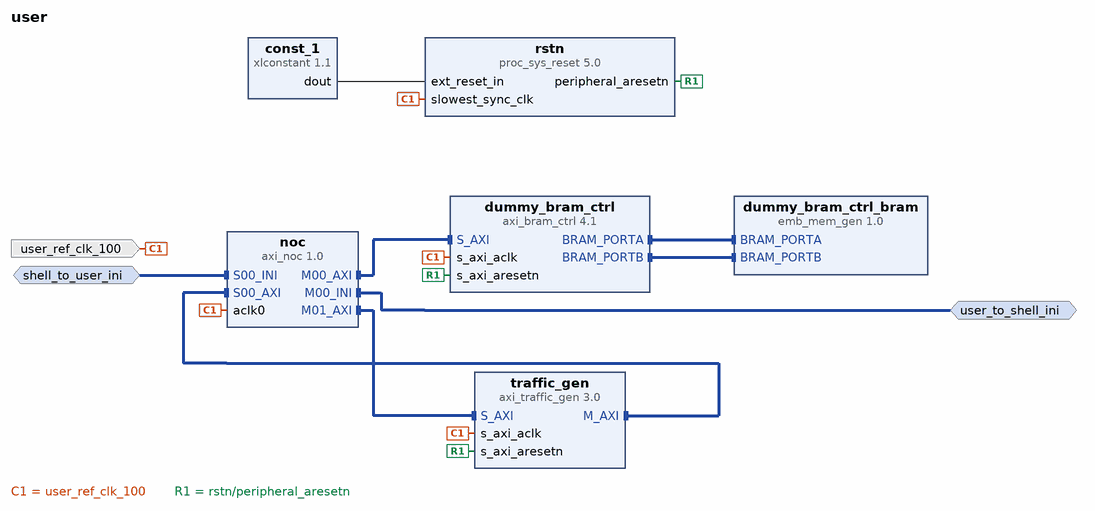
[diagram p0: block diagram of the top level]
# Vivado block design user, xcvc1902-vsvd1760-2MP-e-S, Vivado 2022.2
create_bd_design user

create_bd_intf_port -mode Slave -vlnv xilinx.com:interface:inimm_rtl:1.0 shell_to_user_ini
create_bd_intf_port -mode Master -vlnv xilinx.com:interface:inimm_rtl:1.0 user_to_shell_ini
set_property -dict {CONFIG.INI_STRATEGY load} [get_bd_intf_ports user_to_shell_ini]
create_bd_port -dir I -type clk user_ref_clk_100
set_property -dict {CONFIG.FREQ_HZ 100000000} [get_bd_ports user_ref_clk_100]

create_bd_cell -type ip -vlnv xilinx.com:ip:axi_noc:1.0 noc
set_property -dict {CONFIG.NUM_MI 2 CONFIG.NUM_NMI 1 CONFIG.NUM_NSI 1 CONFIG.NUM_SI 1} [get_bd_cells noc]
create_bd_cell -type ip -vlnv xilinx.com:ip:axi_bram_ctrl:4.1 dummy_bram_ctrl
create_bd_cell -type ip -vlnv xilinx.com:ip:emb_mem_gen:1.0 dummy_bram_ctrl_bram
set_property -dict {CONFIG.MEMORY_PRIMITIVE URAM CONFIG.MEMORY_TYPE True_Dual_Port_RAM} [get_bd_cells dummy_bram_ctrl_bram]
create_bd_cell -type ip -vlnv xilinx.com:ip:proc_sys_reset:5.0 rstn
create_bd_cell -type ip -vlnv xilinx.com:ip:xlconstant:1.1 const_1
create_bd_cell -type ip -vlnv xilinx.com:ip:axi_traffic_gen:3.0 traffic_gen
set_property -dict [list \
  CONFIG.C_ATG_MODE_L2 Basic \
  CONFIG.C_EXTENDED_ADDRESS_WIDTH 64 \
  CONFIG.C_M_AXI_ARUSER_WIDTH 0 \
  CONFIG.C_M_AXI_AWUSER_WIDTH 0 \
  CONFIG.C_M_AXI_DATA_WIDTH 128 \
  CONFIG.C_M_AXI_THREAD_ID_WIDTH 0 \
  CONFIG.C_S_AXI_DATA_WIDTH 32 \
] [get_bd_cells traffic_gen]

# ---- connections ----

connect_bd_intf_net [get_bd_intf_pins dummy_bram_ctrl_bram/BRAM_PORTA] [get_bd_intf_pins dummy_bram_ctrl/BRAM_PORTA]
connect_bd_intf_net [get_bd_intf_pins dummy_bram_ctrl_bram/BRAM_PORTB] [get_bd_intf_pins dummy_bram_ctrl/BRAM_PORTB]
connect_bd_intf_net [get_bd_intf_pins dummy_bram_ctrl/S_AXI] [get_bd_intf_pins noc/M00_AXI]
connect_bd_intf_net [get_bd_intf_pins traffic_gen/S_AXI] [get_bd_intf_pins noc/M01_AXI]
connect_bd_intf_net [get_bd_intf_ports shell_to_user_ini] [get_bd_intf_pins noc/S00_INI]
connect_bd_intf_net [get_bd_intf_pins traffic_gen/M_AXI] [get_bd_intf_pins noc/S00_AXI]
connect_bd_intf_net [get_bd_intf_ports user_to_shell_ini] [get_bd_intf_pins noc/M00_INI]
connect_bd_net -net const_1 [get_bd_pins const_1/dout] [get_bd_pins rstn/ext_reset_in]
connect_bd_net -net core_clk_wiz_core_clk [get_bd_ports user_ref_clk_100] \
  [get_bd_pins dummy_bram_ctrl/s_axi_aclk] [get_bd_pins noc/aclk0] [get_bd_pins traffic_gen/s_axi_aclk] \
  [get_bd_pins rstn/slowest_sync_clk]
connect_bd_net -net core_rstn_0 [get_bd_pins rstn/peripheral_aresetn] \
  [get_bd_pins dummy_bram_ctrl/s_axi_aresetn] [get_bd_pins traffic_gen/s_axi_aresetn]

# ---- address map ----
assign_bd_address -offset 0x0000020100000000 -range 64K -target_address_space [get_bd_addr_spaces shell_to_user_ini] [get_bd_addr_segs dummy_bram_ctrl/S_AXI/Mem0]
assign_bd_address -offset 0x0000020180000000 -range 64K -target_address_space [get_bd_addr_spaces shell_to_user_ini] [get_bd_addr_segs traffic_gen/S_AXI/Reg0]
assign_bd_address -offset 0x0000010000000000 -range 16G -target_address_space [get_bd_addr_spaces traffic_gen/Data] [get_bd_addr_segs user_to_shell_ini/Reg]

validate_bd_design
save_bd_design
